# Altium schematic sheet TMP421 Temperature Sensor.SchDoc: TMP421 Temperature Sensor
size Letter; SheetNumber: 10; SheetTotal: 11
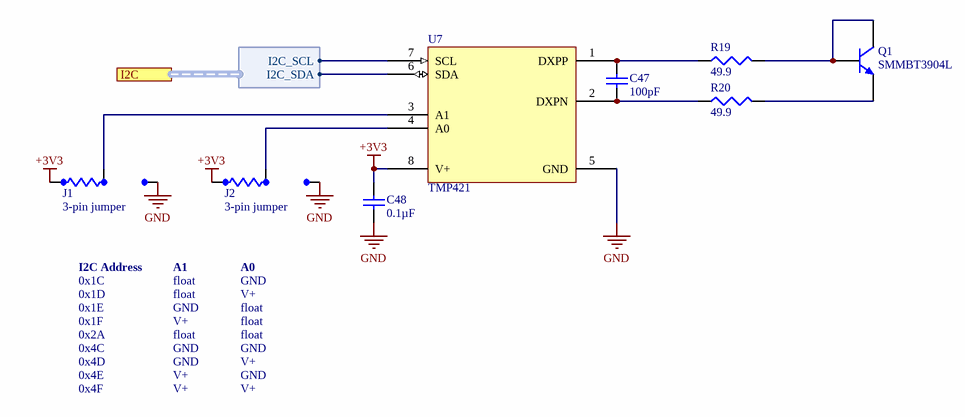
[diagram p0: TMP421 Temperature Sensor.SchDoc]

## Parts
C47  value 100pF  [TDK-CGA2B]  (hidden comment: Cap)
C48  value 0.1µF  [TDK-CGA2B]  (hidden comment: Cap)
J1  3-pin jumper  [PANA-ERJ3EK(3-pin jumper)]
J2  3-pin jumper  [PANA-ERJ3EK(3-pin jumper)]
Q1  SMMBT3904L  [ONS-318-08]
R19  value 49.9  [PANA-ERA2A]  (hidden comment: Res3)
R20  value 49.9  [PANA-ERA2A]  (hidden comment: Res3)
U7  TMP421  [TI-DCN]

## Ports
I2C (harness TMP421_I2C)

## Harnesses
TMP421_I2C: I2C_SCL, I2C_SDA

## Nets
+3V3: C48.1 J1.3 J2.3 U7.8(V+)
GND: C48.2 J1.1 J2.1 U7.5(GND)
NetC47_1: C47.1 R20.1 U7.2(DXPN)
NetC47_2: C47.2 R19.1 U7.1(DXPP)
NetJ1_2: J1.2 U7.3(A1)
NetJ2_2: J2.2 U7.4(A0)
NetQ1_1: Q1.1(B) Q1.3(C) R19.2
NetQ1_2: Q1.2(E) R20.2
NetU7_6: U7.6(SDA) ; port I2C.I2C_SDA
NetU7_7: U7.7(SCL) ; port I2C.I2C_SCL

## Notes on the sheet
- I2C Address
- 0x1C
- A1
- float
- A0
- GND
- 0x1D
- 0x1E
- 0x1F
- 0x2A
- 0x4C
- V+
- 0x4D
- 0x4E
- 0x4F
- (the "License"); you may not use or redistribute this file except in compliance with the License. You
- This file and the information within it are licensed under the terms of the Apache License, Version 2.0
- Copyright
- Unless required by applicable law or agreed to in writing, content distributed under the License is
- distributed on an "AS IS" BASIS, WITHOUT WARRANTIES OR CONDITIONS OF ANY KIND,
- either express or implied. See the License for the specific language governing permissions and
- limitations under the License.
- may obtain a copy of the License at:
- http://www.apache.org/licenses/LICENSE-2.0
- Title
- Size:
- Date:
- Letter
- Number:
- Time:
- Revision:
- Sheet
- of
- University of Alberta
- Deptartment of Electrical
- and Computer Engineering
- Edmonton AB, Canada
- T6G 1H9
- File:

## Library data of the parts
C47 = PC-TDK-01226: CAP CER 100PF 100V C0G 0402; Manufacturer Part Number: CGA2B2C0G2A101J050BA; Index: 1226; Designator: C?; Tolerance: ±5%; Temperature Coefficient: NP0; Published: 2016-03-16; LatestRevisionDate: 2016-03-16; LatestRevisionNote: ...; PackageReference: 0402 (1005 Metric); Publisher: AlbertaSat; PackageDescription: Radial Cap, Thru-Hole; 2 Leads; 0.3 in Pin Spacing; Part Number: PC-TDK-01226; Supplier Part Number 1: 445-15510-1-ND; Supplier 1: Digi-key; Supplier Link: http://www.digikey.ca/product-search/en?keywords=445-15510-1-ND; Voltage - Rated: 100V; Applications: Automotive
C48 = PC-TDK-02259: CAP CER 0.1UF 50V X7R 0402; Manufacturer Part Number: CGA2B3X7R1H104K050BB; Index: 2259; Designator: C?; Tolerance: ±10%; Published: 2016-03-16; LatestRevisionDate: 2016-03-16; LatestRevisionNote: ...; PackageReference: 0402 (1005 Metric); Publisher: AlbertaSat; PackageDescription: Radial Cap, Thru-Hole; 2 Leads; 0.3 in Pin Spacing; Part Number: PC-TDK-02259; Supplier Part Number 1: 445-6899-1-ND; Supplier 1: Digi-key; Supplier Link: http://www.digikey.ca/product-search/en?keywords=445-6899-1-ND; Voltage - Rated: 50V; Temperature Coefficient: X7R; Applications: Automotive
J1 J2 = 19867: Part Number: 19867; Supplier 1: Digi-Key
Q1 = PU-ONS-00001: TRANS NPN 40V 0.2A SOT23; Manufacturer Part Number: SMMBT3904LT1G; Index: 1; Designator: Q?; Part Number: PU-ONS-00001; Supplier Part Number 1: SMMBT3904LT1GOSCT-ND; Supplier 1: Digi-key; Supplier Part Number 2: 863-SMMBT3904LT1G; Supplier 2: Mouser; Publisher: AlbertaSat; Published: 2018-08-18; LatestRevisionDate: 2018-08-18; LatestRevisionNote: ...; PackageReference: SOT-23-3 (TO-236); PackageDescription: SOT23, 3-Leads, Body 2.92x2.37mm, Pitch 0.95mm, IPC Low Density; Supplier Link: #https://www.digikey.ca/product-detail/en/on-semiconductor/SMMBT3904LT1G/SMMBT3904LT1GOSCT-ND/4331837#
R19 R20 = 13731: RES SMD 49.9 OHM 0.1% 1/16W 0402; Part Number: 13731; Manufacturer Part Number: ERA-2AEB49R9X; Designator: R?; Power: 0.063W, 1/16W; Temperature Coefficient: ±25ppm/°C; Published: 8-Jun-2000; LatestRevisionDate: 29-May-2009; LatestRevisionNote: IPC-7351 Footprint Added.; PackageReference: 0402 (1005 Metric); Publisher: Altium Limited; PackageDescription: Chip Resistor, 2-Leads, Body 1.00x0.50mm, IPC Low Density; Supplier Part Number 1: P49.9DCCT-ND; Supplier 1: Digi-Key; Supplier Link: http://www.digikey.ca/product-search/en?keywords=P49.9DCCT-ND; Tolerance: ±0.1%
U7 = 40: SENSOR TEMPERATURE SMBUS SOT23-8; Part Number: 40; Manufacturer Part Number: TMP421AIDCNR; Designator: U?; Supplier Part Number 2: 595-TMP421AIDCNR; Supplier 2: Mouser; Supplier Part Number 1: 296-35959-1-ND; Supplier 1: Digi-Key; Supplier Link: #https://www.digikey.ca/product-detail/en/texas-instruments/TMP421AIDCNR/296-35959-1-ND/4135040#; PackageReference: SOT-23-8; Operating Temperature: -40°C ~ 125°C